# EAGLE design 2020-11-23 BOSS-RoboClaw-Interface (EAGLE 9.6.2)
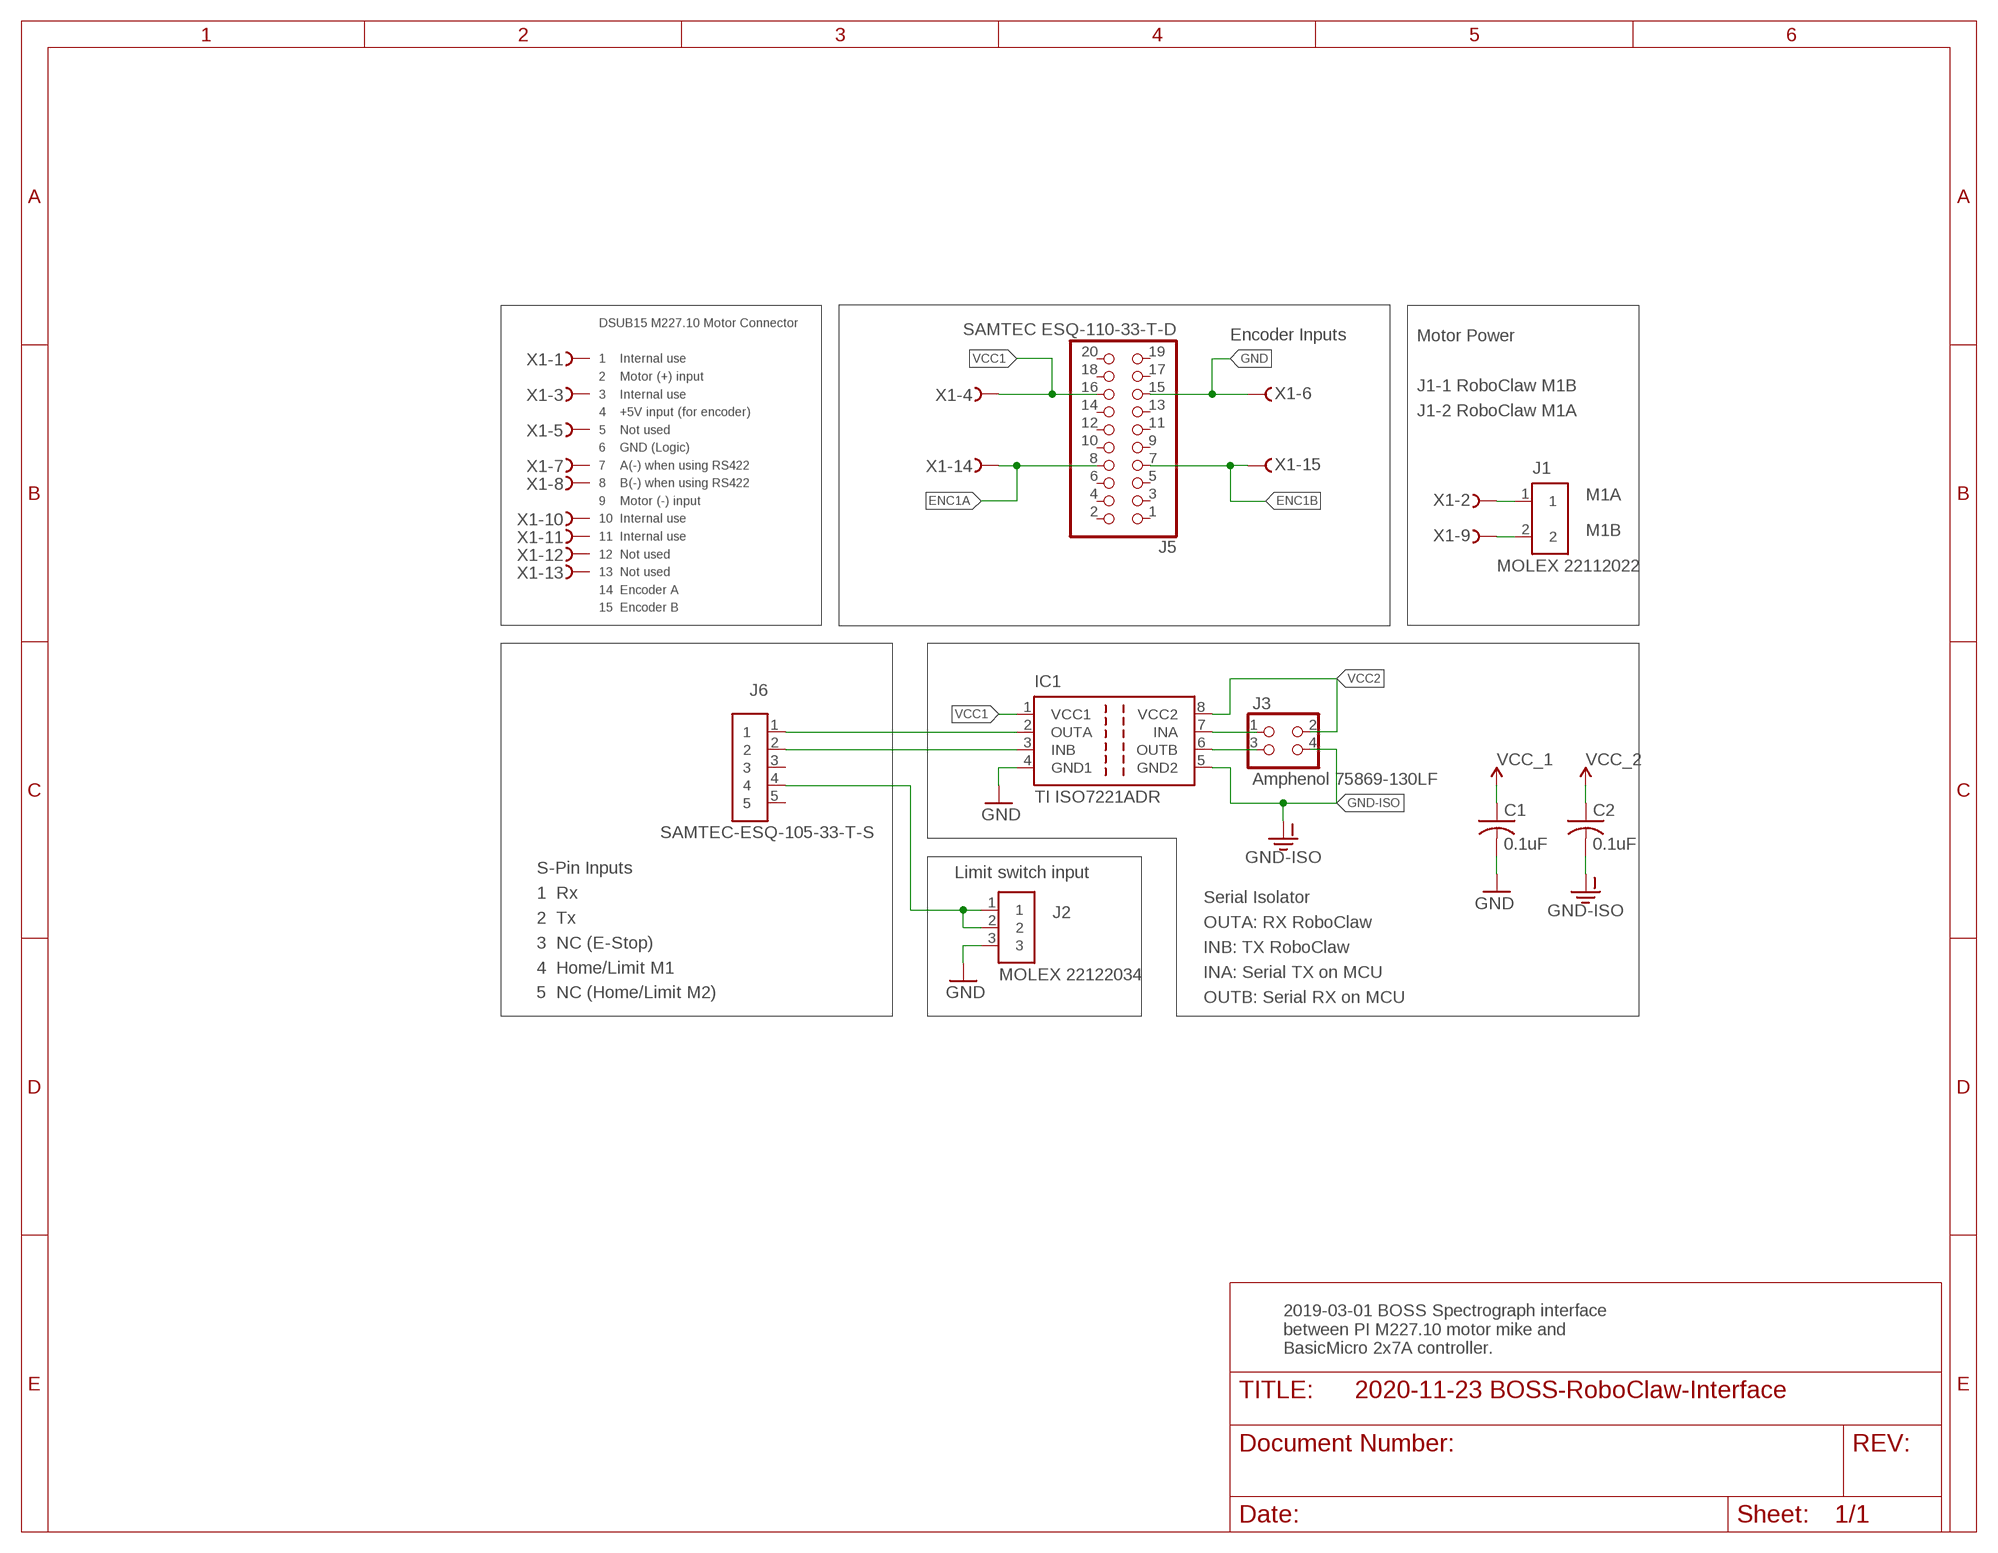
[diagram p0: schematic, sheet 1]

## Parts
C1  0.1uF  C-USC0805  [C0805]
C2  0.1uF  C-USC0805  [C0805]
IC1  TI ISO7221ADR  ISO7221ISO7221  [SO-08-ISO7221]
J1  MOLEX 22112022  PINHD-1X2-MOLEX-22112022  [1X02-MOLEX-22112022]
J2  MOLEX 22122034  PINHD-1X3RA-MOLEX-22122034  [1X03RA-MOLEX-22122034]
J3  Amphenol 75869-130LF  PINHD-2X2AMP-75869-130LF  [2X02-SHROUD]
J5  SAMTEC ESQ-110-33-T-D  PINHD-2X10-ESQ-110-33-T-DSAMTEC  [2X10-ESQ-110-33-T-D]
J6  SAMTEC-ESQ-105-33-T-S  PINHD-1X5-ESQ-105-33-T-S  [1X05-ESQ-105-33-T-S]
X1  Amphenol L77SDAH15SOL2RM8C309  D-SUB15-H2R15ST  [H2R15ST]

## Nets
ENC1A: J5.8 X1.14
ENC1B: J5.7 X1.15
GND: C1.2 IC1.4(GND1) J2.3 J5.15 X1.6
GND-ISO: C2.2 IC1.5(GND2) J3.4
LIMIT: J2.1 J2.2 J6.4
M1A: J1.1 X1.2
M1B: J1.2 X1.9
RX: IC1.2(OUTA) J6.1
RXMCU: IC1.6(OUTB) J3.3
TX: IC1.3(INB) J6.2
TXMCU: IC1.7(INA) J3.1
VCC1: C1.1 IC1.1(VCC1) J5.16 X1.4 ; supply symbol labelled VCC_1
VCC2: C2.1 IC1.8(VCC2) J3.2 ; supply symbol labelled VCC_2
Unconnected: J5.1 J5.2 J5.3 J5.4 J5.5 J5.6 J5.9 J5.10 J5.11 J5.12 J5.13 J5.14 J5.17 J5.18 J5.19 J5.20 J6.3 J6.5 X1.1 X1.3 X1.5 X1.7 X1.8 X1.10 X1.11 X1.12 X1.13

## Notes on the sheet
- Encoder Inputs
- Motor Power
  
  J1-1 RoboClaw M1B
  J1-2 RoboClaw M1A
- DSUB15 M227.10 Motor Connector
  
  1    Internal use
  2    Motor (+) input
  3    Internal use
  4    +5V input (for encoder)
  5    Not used
  6    GND (Logic)
  7    A(-) when using RS422
  8    B(-) when using RS422
  9    Motor (-) input
  10  Internal use
  11  Internal use
  12  Not used
  13  Not used
  14  Encoder A
  15  Encoder B
- Limit switch input
- S-Pin Inputs
  1  Rx
  2  Tx
  3  NC (E-Stop)
  4  Home/Limit M1
  5  NC (Home/Limit M2)
- Serial Isolator
  OUTA: RX RoboClaw
  INB: TX RoboClaw
  INA: Serial TX on MCU
  OUTB: Serial RX on MCU
- 2019-03-01 BOSS Spectrograph interface
  between PI M227.10 motor mike and
  BasicMicro 2x7A controller.

## Library data of the parts
C1 C2 = AUmlib:C-US: CAPACITOR, American symbol; SPICEPREFIX: C
IC1 = AUmlib:ISO7221: DUAL DIGITAL ISOLATORS Source: http://focus.ti.com/lit/ds/symlink/iso7221a.pdf
J1 = AUmlib:PINHD-1X2-MOLEX-22112022
J2 = AUmlib:PINHD-1X3RA-MOLEX-22122034
J3 = AUmlib:PINHD-2X2: PIN HEADER
J5 = AUmlib:PINHD-2X10-ESQ-110-33-T-D: PIN HEADER
J6 = AUmlib:PINHD-1X5-ESQ-105-33-T-S
X1 = AUmlib:D-SUB15-: D-Subminiatur Connector Source: Electronioc Interconnects European Edition 1998; OC_FARNELL: unknown; OC_NEWARK: unknown

## Board
Basic Micro 2x7A RoboClaw interface to PI M-227.10 motor mikel.
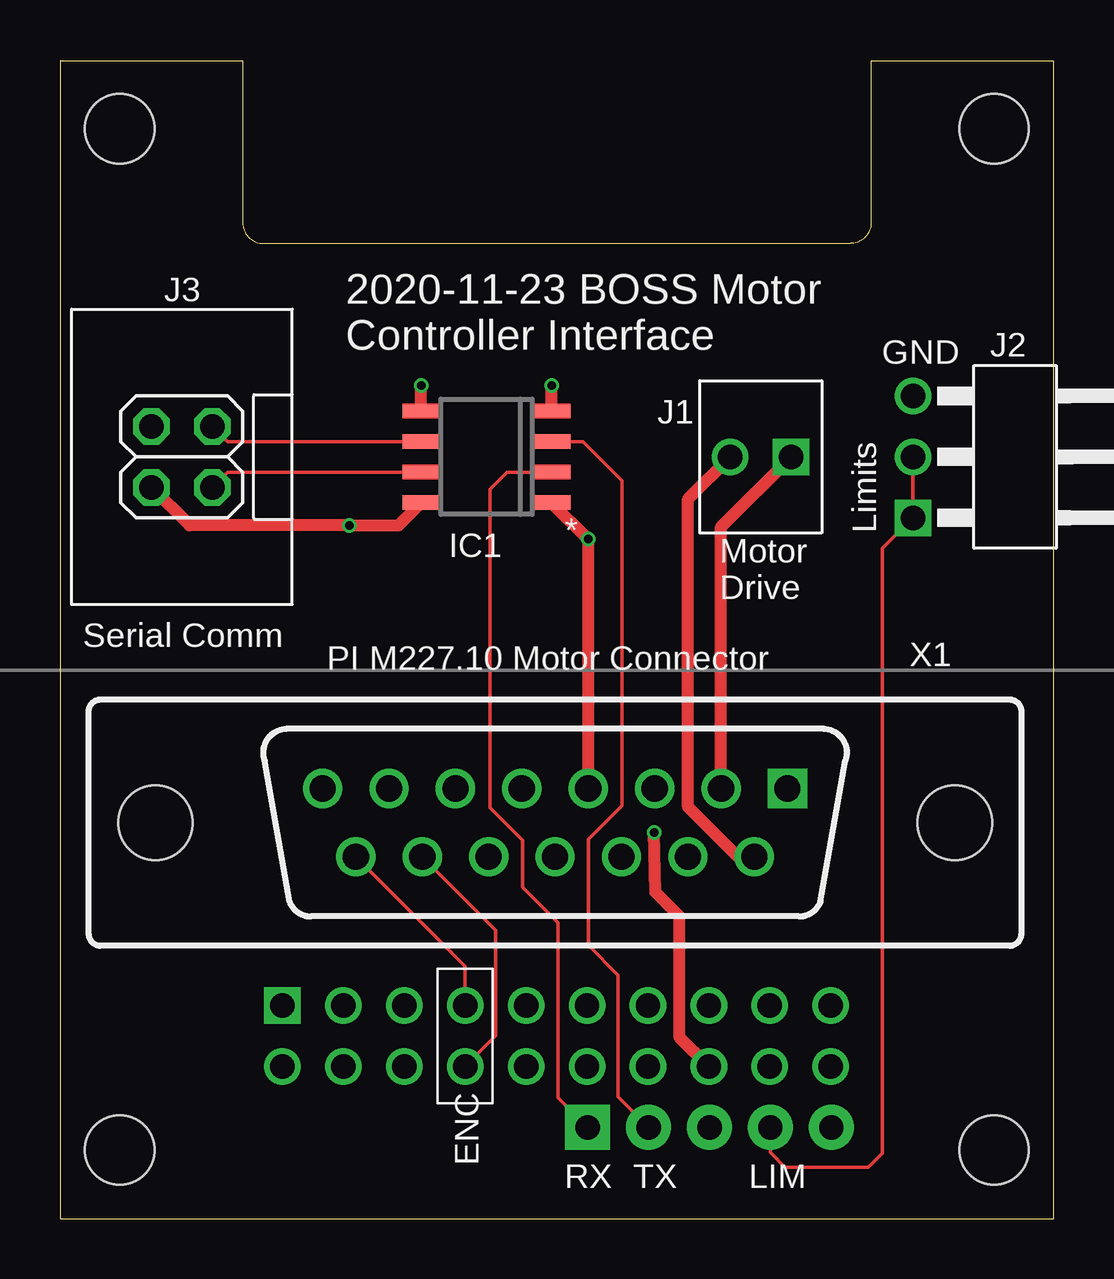
[diagram p1: board, top side]
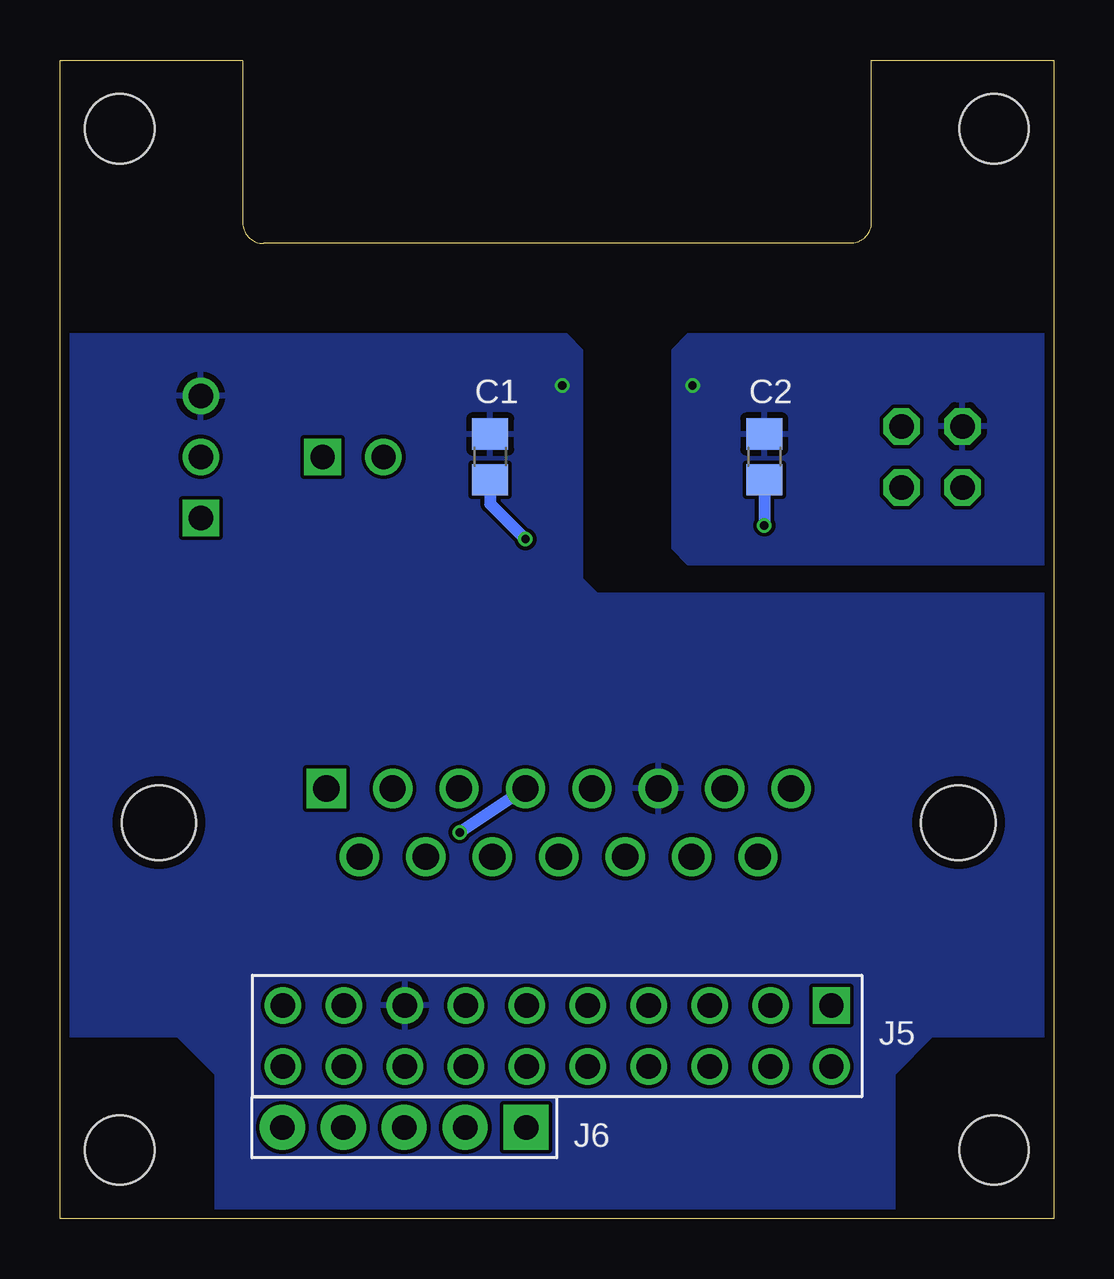
[diagram p2: board, bottom side, seen from below]

Size 41.43 x 48.29 mm. Coordinates in mm from the lower left corner, seen from the top.
Outline: 0,48.28 0,48.26
Outline: 0,48.26 0,0 41.43,0 41.43,48.26 33.81,48.26 33.81,41.5 arc-90 32.94,40.64 8.48,40.64 arc-90 7.62,41.5 7.62,48.26 0,48.26
Copper layers (1*16): Top 0.035559375mm / dielectric 1.6mm / Bottom 0.035559375mm
Design rules "oshpark-2layer": minimum track width 6mil, minimum drill 10mil, track to track 6mil, track to pad 6mil, pad to pad 6mil, via to via 6mil, smd to smd 6mil, copper to edge 15mil, drill to drill 6mil, minimum pad ring 5mil, minimum via ring 5mil, stop-mask expansion 2.5mil, vias tented up to drill 0mil, thermal gap 10mil
Holes 2.9 mm at 2.49,2.87 2.49,45.42 38.94,45.42 38.94,2.87

### Footprints (pad centres in the part's own frame; a part is rotated, then mirrored left to right if it is on the bottom)
C0805 = smd 1.3 x 1.5: 1 -0.95,0; 2 0.95,0
SO-08-ISO7221 = smd 1.549 x 0.61: 1 -2.718,1.905; 2 -2.718,0.635; 3 -2.718,-0.635; 4 -2.718,-1.905; 5 2.718,-1.905; 6 2.718,-0.635; 7 2.718,0.635; 8 2.718,1.905
1X02-MOLEX-22112022 = drill 1.016 square: 1 -1.27,0 | drill 1.016: 2 1.27,0
1X03RA-MOLEX-22122034 = drill 1.016 square: 1 -2.54,3.81 | drill 1.016: 2 0,3.81; 3 2.54,3.81
2X02-SHROUD = drill 1.016 octagon: 1 -1.27,-1.27; 2 -1.27,1.27; 3 1.27,-1.27; 4 1.27,1.27
2X10-ESQ-110-33-T-D = drill 1.016 square: 1 -11.43,-1.27 | drill 1.016: 2 -11.43,1.27; 3 -8.89,-1.27; 4 -8.89,1.27; 5 -6.35,-1.27; 6 -6.35,1.27; 7 -3.81,-1.27; 8 -3.81,1.27; 9 -1.27,-1.27; 10 -1.27,1.27; 11 1.27,-1.27; 12 1.27,1.27; 13 3.81,-1.27; 14 3.81,1.27; 15 6.35,-1.27; 16 6.35,1.27; 17 8.89,-1.27; 18 8.89,1.27; 19 11.43,-1.27; 20 11.43,1.27
1X05-ESQ-105-33-T-S = drill 1.016 pad 1.88 square: 1 -5.08,0 | drill 1.016 pad 1.88: 2 -2.54,0; 3 0,0; 4 2.54,0; 5 5.08,0
H2R15ST = drill 1.092 square: 1 9.69,1.422 | drill 1.092: 2 6.921,1.422; 3 4.153,1.422; 4 1.384,1.422; 5 -1.384,1.422; 6 -4.153,1.422; 7 -6.921,1.422; 8 -9.69,1.422; 9 8.306,-1.422; 10 5.537,-1.422; 11 2.769,-1.422; 12 0,-1.422; 13 -2.769,-1.422; 14 -5.537,-1.422; 15 -8.306,-1.422 | hole 3.1: -16.662,0; 16.662,0

### Placement (x,y rotation side)
C1  23.5,31.75 90 bottom
C2  12.06,31.75 90 bottom
IC1  17.78,31.75 180 top
J1  29.21,31.75 180 top
J2  39.37,31.75 90 top
J3  5.08,31.75 90 top
J5  20.7,7.62 180 bottom
J6  27.08,3.81 180 bottom
X1  20.64,16.51 0 top

### Tracks (layer width: path | path; a pad name or v marks a point on that pad's centre or on a via)
ENC1A
  Top 0.152: X1.14 18.16,12.03 18.16,7.62 J5.8
ENC1B
  Top 0.152: X1.15 16.89,10.53 J5.7
GND  (via drill 0.35)
  Top 0.508: IC1.4 v20.5,34.72
  pour Bottom: 19.68,36.2 20.32,36.83 41.43,36.83 41.43,7.62 36.51,7.62 34.92,6.03 34.92,0 6.67,0 6.67,6.03 5.08,7.62 0,7.62 0,26.04 19.05,26.04 19.68,26.67
GND-ISO  (via drill 0.35)
  Top 0.508: IC1.5 v15.06,34.72
  pour Bottom: 0,27.3 15.24,27.3 15.88,27.94 15.88,36.2 15.24,36.83 0,36.83
LIMIT
  Top 0.152: J2.2 J2.1 34.29,27.94 34.29,2.74 33.71,2.16 30.23,2.16 29.62,2.77 J6.4
M1A
  Top 0.508: X1.2 27.56,28.83 J1.1
M1B
  Top 0.508: X1.9 28.27,15.09 26.19,17.17 26.19,30 J1.2
RX
  Top 0.152: IC1.2 18.64,31.11 17.93,30.4 17.93,17.12 19.28,15.77 19.28,13.82 20.75,12.34 20.75,5.05 J6.1
RXMCU
  Top 0.152: J3.3 6.99,32.38 IC1.6
TX
  Top 0.152: IC1.3 21.79,32.38 23.42,30.76 23.42,17.22 22.02,15.82 22.02,11.4 23.27,10.16 23.27,5.08 J6.2
TXMCU
  Top 0.152: J3.1 6.99,31.11 IC1.7
VCC1  (via drill 0.35)
  Top 0.508: v24.77,16.1 24.82,13.61 25.81,12.62 25.81,7.59 J5.16 | X1.4 v22.02,28.32 IC1.1
  Bottom 0.508: v24.77,16.1 X1.4 | C1.1 23.5,29.79 v22.02,28.32
VCC2  (via drill 0.35)
  Top 0.508: J3.2 5.4,28.89 v12.06,28.89 14.11,28.89 IC1.8
  Bottom 0.508: C2.1 v12.06,28.89

### Text on the board
tPlace: 2020-11-23 BOSS Motor / Controller Interface | GND | Limits | Motor / Drive | Serial Comm | PI M227.10 Motor Connector | ENC | RX | TX | LIM
tDocu: PI DB-15 Motor Connector Edge